# Altium schematic sheet Sheet1.SchDoc
size A3
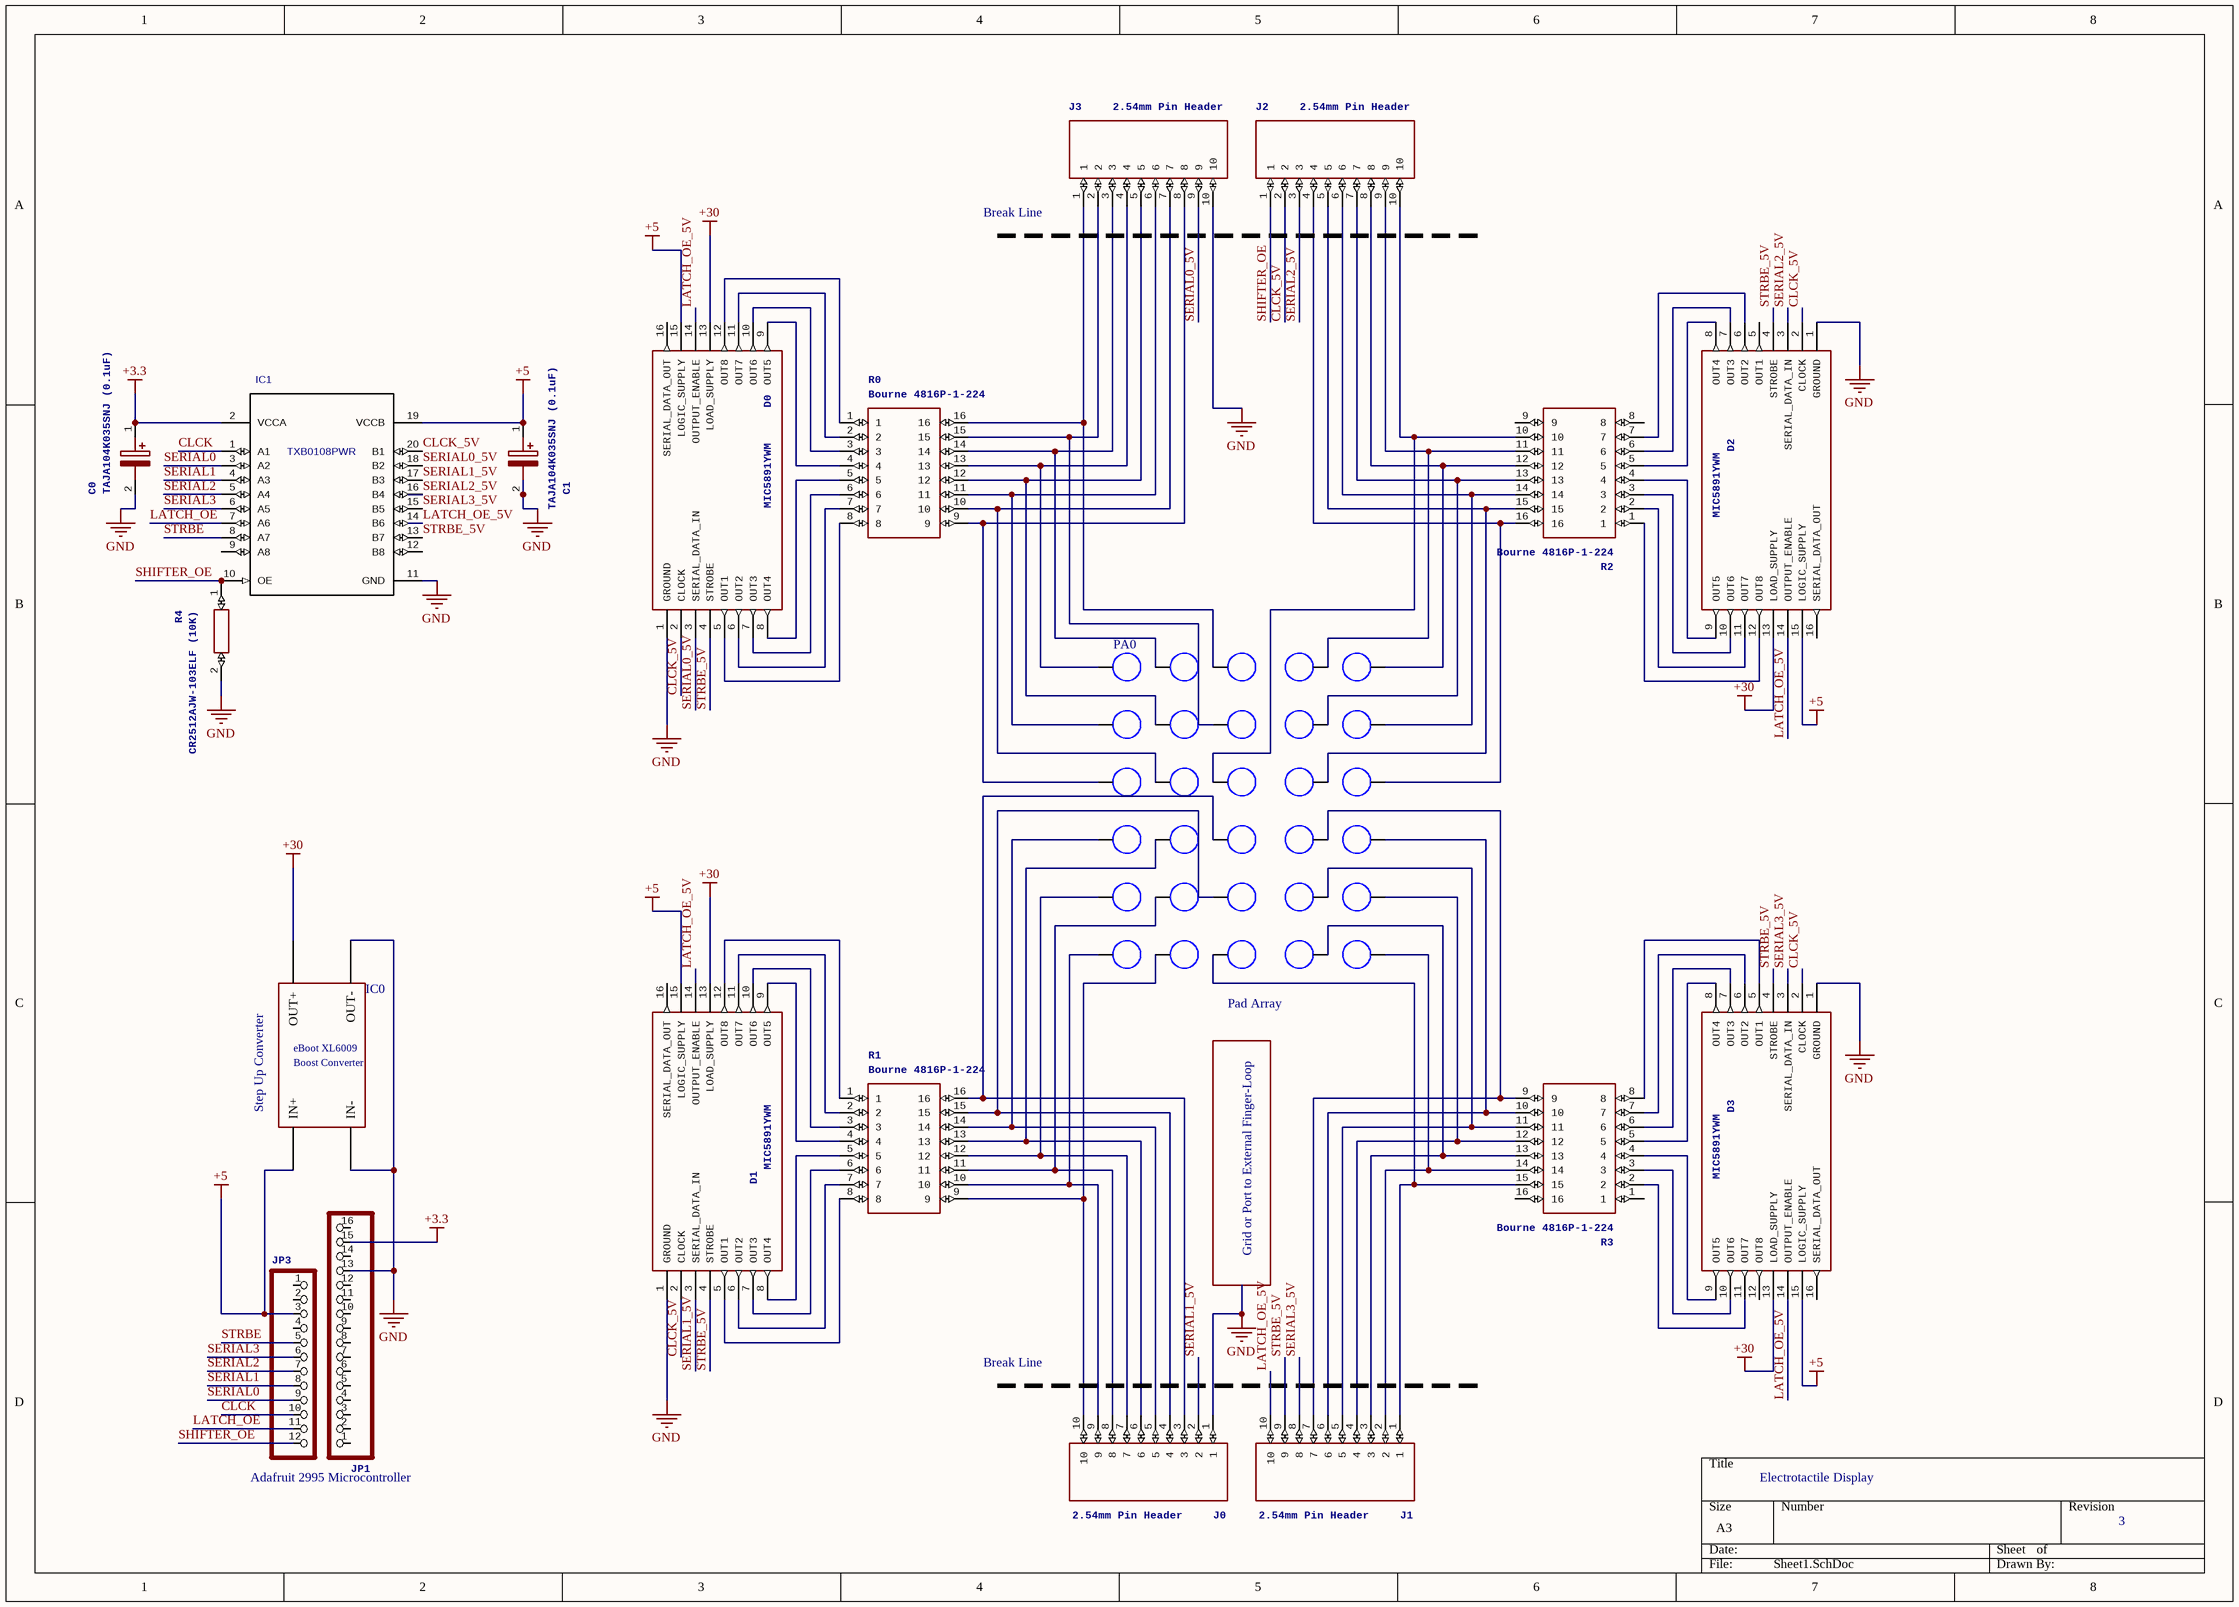
[diagram p0: Sheet1.SchDoc]

## Parts
C0  TAJA104K035SNJ (0.1uF)  [CAPPM3216X180N]
C1  TAJA104K035SNJ (0.1uF)  [CAPPM3216X180N]
D0  MIC5891YWM  [SOIC127P1031X264-16N]
D1  MIC5891YWM  [SOIC127P1031X264-16N]
D2  MIC5891YWM  [SOIC127P1031X264-16N]
D3  MIC5891YWM  [SOIC127P1031X264-16N]
IC0  Step Up Converter
IC1  TXB0108PWR  [PW0020A_N]
J0  2.54mm Pin Header  [HDRV10W64P0X254_1X10_2540X254X]
J1  2.54mm Pin Header  [HDRV10W64P0X254_1X10_2540X254X]
J2  2.54mm Pin Header  [HDRV10W64P0X254_1X10_2540X254X]
J3  2.54mm Pin Header  [HDRV10W64P0X254_1X10_2540X254X]
JP1  HEADER-1X16ROUND  [1X16_ROUND]  (value not drawn)
JP3  HEADER-1X12  [1X12_ROUND]  (value not drawn)
PA0  Pad Array
R0  Bourne 4816P-1-224  [SOIC127P762X215-16N]
R1  Bourne 4816P-1-224  [SOIC127P762X215-16N]
R2  Bourne 4816P-1-224  [SOIC127P762X215-16N]
R3  Bourne 4816P-1-224  [SOIC127P762X215-16N]
R4  CR2512AJW-103ELF (10K)  [RESC6332X70N]

## Nets
+3.3: C0.1(+) IC1.2(VCCA) JP1.15
+5: C1.1(+) D0.15(LOGIC_SUPPLY) D1.15(LOGIC_SUPPLY) D2.15(LOGIC_SUPPLY) D3.15(LOGIC_SUPPLY) IC0.2(IN+) IC1.19(VCCB) JP3.3
+30: D0.13(LOAD_SUPPLY) D1.13(LOAD_SUPPLY) D2.13(LOAD_SUPPLY) D3.13(LOAD_SUPPLY) IC0.0(OUT+)
GND: C0.2(-) C1.2(-) D0.1(GROUND) D1.1(GROUND) D2.1(GROUND) D3.1(GROUND) IC0.1(OUT-) IC0.3(IN-) IC1.11(GND) J0.1 J3.10 JP1.13 R4.2
CLCK: IC1.1(A1) JP3.10
CLCK_5V: D0.2(CLOCK) D1.2(CLOCK) D2.2(CLOCK) D3.2(CLOCK) IC1.20(B1) J2.2
LATCH_OE: IC1.7(A6) JP3.11
LATCH_OE_5V: D0.14(OUTPUT_ENABLE) D1.14(OUTPUT_ENABLE) D2.14(OUTPUT_ENABLE) D3.14(OUTPUT_ENABLE) IC1.14(B6) J1.10
SERIAL0: IC1.3(A2) JP3.9
SERIAL0_5V: D0.3(SERIAL_DATA_IN) IC1.18(B2) J3.9
SERIAL1: IC1.4(A3) JP3.8
SERIAL1_5V: D1.3(SERIAL_DATA_IN) IC1.17(B3) J0.2
SERIAL2: IC1.5(A4) JP3.7
SERIAL2_5V: D2.3(SERIAL_DATA_IN) IC1.16(B4) J2.3
SERIAL3: IC1.6(A5) JP3.6
SERIAL3_5V: D3.3(SERIAL_DATA_IN) IC1.15(B5) J1.8
SHIFTER_OE: IC1.10(OE) J2.1 JP3.12 R4.1
STRBE: IC1.8(A7) JP3.5
STRBE_5V: D0.4(STROBE) D1.4(STROBE) D2.4(STROBE) D3.4(STROBE) IC1.13(B7) J1.9
NetD0_5: D0.5(OUT1) R0.8
NetD0_6: D0.6(OUT2) R0.7
NetD0_7: D0.7(OUT3) R0.6
NetD0_8: D0.8(OUT4) R0.5
NetD0_9: D0.9(OUT5) R0.4
NetD0_10: D0.10(OUT6) R0.3
NetD0_11: D0.11(OUT7) R0.2
NetD0_12: D0.12(OUT8) R0.1
NetD1_5: D1.5(OUT1) R1.8
NetD1_6: D1.6(OUT2) R1.7
NetD1_7: D1.7(OUT3) R1.6
NetD1_8: D1.8(OUT4) R1.5
NetD1_9: D1.9(OUT5) R1.4
NetD1_10: D1.10(OUT6) R1.3
NetD1_11: D1.11(OUT7) R1.2
NetD1_12: D1.12(OUT8) R1.1
NetD2_6: D2.6(OUT2) R2.7
NetD2_7: D2.7(OUT3) R2.6
NetD2_8: D2.8(OUT4) R2.5
NetD2_9: D2.9(OUT5) R2.4
NetD2_10: D2.10(OUT6) R2.3
NetD2_11: D2.11(OUT7) R2.2
NetD2_12: D2.12(OUT8) R2.1
NetD3_5: D3.5(OUT1) R3.8
NetD3_6: D3.6(OUT2) R3.7
NetD3_7: D3.7(OUT3) R3.6
NetD3_8: D3.8(OUT4) R3.5
NetD3_9: D3.9(OUT5) R3.4
NetD3_10: D3.10(OUT6) R3.3
NetD3_11: D3.11(OUT7) R3.2
NetJ0_3: J0.3 PA0.4 R1.16
NetJ0_4: J0.4 PA0.4 R1.15
NetJ0_5: J0.5 PA0.4 R1.14
NetJ0_6: J0.6 PA0.4 R1.13
NetJ0_7: J0.7 PA0.4 R1.12
NetJ0_8: J0.8 PA0.4 R1.11
NetJ0_9: J0.9 PA0.4 R1.10
NetJ0_10: J0.10 PA0.4 R1.9
NetJ1_1: J1.1 PA0.4 R3.15
NetJ1_2: J1.2 PA0.4 R3.14
NetJ1_3: J1.3 PA0.4 R3.13
NetJ1_4: J1.4 PA0.4 R3.12
NetJ1_5: J1.5 PA0.4 R3.11
NetJ1_6: J1.6 PA0.4 R3.10
NetJ1_7: J1.7 PA0.4 R3.9
NetJ2_4: J2.4 PA0.4 R2.16
NetJ2_5: J2.5 PA0.4 R2.15
NetJ2_6: J2.6 PA0.4 R2.14
NetJ2_7: J2.7 PA0.4 R2.13
NetJ2_8: J2.8 PA0.4 R2.12
NetJ2_9: J2.9 PA0.4 R2.11
NetJ2_10: J2.10 PA0.4 R2.10
NetJ3_1: J3.1 PA0.4 R0.16
NetJ3_2: J3.2 PA0.4 R0.15
NetJ3_3: J3.3 PA0.4 R0.14
NetJ3_4: J3.4 PA0.4 R0.13
NetJ3_5: J3.5 PA0.4 R0.12
NetJ3_6: J3.6 PA0.4 R0.11
NetJ3_7: J3.7 PA0.4 R0.10
NetJ3_8: J3.8 PA0.4 R0.9

Not connected (* = marked no-connect by the designer): D0 16(SERIAL_DATA_OUT); D1 16(SERIAL_DATA_OUT); D2 5(OUT1) 16(SERIAL_DATA_OUT); D3 12(OUT8) 16(SERIAL_DATA_OUT); IC1 9(A8) 12(B8); JP1 1 2 3 4 5 6 7 8 9 10 11 12 14 16; JP3 1 2 4; R2 8 9; R3 1 16

## Notes on the sheet
- (near J3) Break Line
- Grid or Port to External Finger-Loop
- Break Line
- Adafruit 2995 Microcontroller
- Electrotactile Display
- 3
- (in symbol Component_1) eBoot XL6009; Boost Converter

## Library data of the parts
C0 C1 = TAJA104K035SNJ: Manufacturer_Name: AVX; GateName_1: G$1; SymbolName_1: TAJA104K035SNJ; LibraryName: TAJA104K035SNJ; DeviceSetName: TAJA104K035SNJ; Mouser_Part_Number: 581-TAJA104K035SNJ; Mouser_Price-Stock: https://www.mouser.co.uk/ProductDetail/AVX/TAJA104K035SNJ?qs=0%252BYwpxhRXZhtcvceHRBYuQ%3D%3D; Manufacturer_Part_Number: TAJA104K035SNJ; Height: 1.8mm
D0-D3 = MIC5891YWM: Manufacturer_Name: Microchip; GateName_1: G$1; SymbolName_1: MIC5891YWM; LibraryName: MIC5891YWM; DeviceSetName: MIC5891YWM; Mouser_Part_Number: 998-MIC5891YWM; Mouser_Price-Stock: https://www.mouser.com/Search/Refine.aspx?Keyword=998-MIC5891YWM; Manufacturer_Part_Number: MIC5891YWM; Height: 2.64mm
IC0 PA0 = Component_1
IC1 = TXB0108PWR: Manufacturer: Texas Instruments; PartNumber: TXB0108PWR; Value: Value
J0-J3 = 61301011121: Manufacturer_Name: Wurth Elektronik; GateName_1: G$1; SymbolName_1: 61301011121; LibraryName: 61301011121; DeviceSetName: 61301011121; Mouser_Part_Number: 710-61301011121; Mouser_Price-Stock: https://www.mouser.co.uk/ProductDetail/Wurth-Elektronik/61301011121?qs=ZtY9WdtwX548wETl0P4xpA%3D%3D; Manufacturer_Part_Number: 61301011121; Height: 8.54mm
JP1 = HEADER-1X16ROUND: PIN HEADER; GateName_1: A; SymbolName_1: PINHD16; DeviceName: ROUND; LibraryName: microbuilder; DeviceSetName: HEADER-1X16
JP3 = HEADER-1X12: GateName_1: G$1; SymbolName_1: PINHD12; LibraryName: microbuilder; DeviceSetName: HEADER-1X12
R0-R3 = 4816P-1-223LF: Manufacturer_Name: Bourns; GateName_1: G$1; SymbolName_1: 4816P-1-223LF; LibraryName: 4816P-1-223LF; DeviceSetName: 4816P-1-223LF; Mouser_Part_Number: 652-4816P-1LF-22K; Mouser_Price-Stock: https://www.mouser.co.uk/ProductDetail/Bourns/4816P-1-223LF?qs=yksRZAkH7guQI1U0uopZyw%3D%3D; Manufacturer_Part_Number: 4816P-1-223LF; Height: 2.15mm
R4 = CR2512AJW-103ELF: Manufacturer_Name: Bourns; GateName_1: G$1; SymbolName_1: CR2512AJW-103ELF; LibraryName: CR2512AJW-103ELF; DeviceSetName: CR2512AJW-103ELF; Mouser_Part_Number: 652-CR2512AJW-103ELF; Mouser_Price-Stock: https://www.mouser.co.uk/ProductDetail/Bourns/CR2512AJW-103ELF?qs=GedFDFLaBXEqggePGBQmuQ%3D%3D; Manufacturer_Part_Number: CR2512AJW-103ELF; Height: 0.7mm